# Altium schematic sheet MR_main.SchDoc
size A4; CompanyName: BeeIonic; SheetNumber: 1; SheetTotal: 7
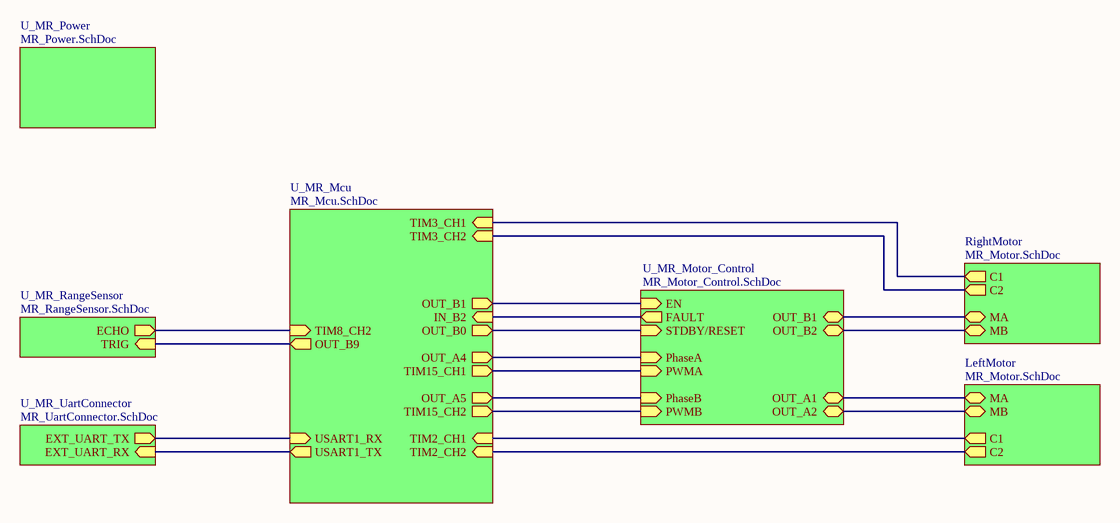
[diagram p0: MR_main.SchDoc]

## Sub-sheets
LeftMotor = MR_Motor.SchDoc: MA (bidir), C1 (out), C2 (out), MB (bidir)
RightMotor = MR_Motor.SchDoc: MA (bidir), C1 (out), C2 (out), MB (bidir)
U_MR_Mcu = MR_Mcu.SchDoc: TIM15_CH2 (out), TIM2_CH1 (in), TIM3_CH2 (in), TIM2_CH2 (in), USART1_RX (in), TIM15_CH1 (out), TIM3_CH1 (in), USART1_TX (out), OUT_B1 (out), OUT_A4 (out), OUT_A5 (out), IN_B2 (in), OUT_B0 (out), TIM8_CH2 (in), OUT_B9 (out)
U_MR_Motor_Control = MR_Motor_Control.SchDoc: OUT_A1 (bidir), PWMB (in), OUT_B1 (bidir), OUT_A2 (bidir), OUT_B2 (bidir), FAULT (out), PhaseA (in), PhaseB (in), STDBY/RESET (in), EN (in), PWMA (in)
U_MR_Power = MR_Power.SchDoc: no entries
U_MR_RangeSensor = MR_RangeSensor.SchDoc: ECHO (out), TRIG (in)
U_MR_UartConnector = MR_UartConnector.SchDoc: EXT_UART_RX (in), EXT_UART_TX (out)

## Nets
(unnamed): sheet U_MR_Mcu/TIM15_CH2, sheet U_MR_Motor_Control/PWMB
(unnamed): sheet U_MR_Mcu/TIM2_CH1, sheet LeftMotor/C1
(unnamed): sheet U_MR_Mcu/TIM3_CH2, sheet RightMotor/C2
(unnamed): sheet U_MR_Mcu/TIM2_CH2, sheet LeftMotor/C2
(unnamed): sheet U_MR_Mcu/USART1_RX, sheet U_MR_UartConnector/EXT_UART_TX
(unnamed): sheet U_MR_Mcu/TIM15_CH1, sheet U_MR_Motor_Control/PWMA
(unnamed): sheet U_MR_Mcu/TIM3_CH1, sheet RightMotor/C1
(unnamed): sheet U_MR_Mcu/USART1_TX, sheet U_MR_UartConnector/EXT_UART_RX
(unnamed): sheet U_MR_Mcu/OUT_B1, sheet U_MR_Motor_Control/EN
(unnamed): sheet U_MR_Mcu/OUT_A4, sheet U_MR_Motor_Control/PhaseA
(unnamed): sheet U_MR_Mcu/OUT_A5, sheet U_MR_Motor_Control/PhaseB
(unnamed): sheet U_MR_Mcu/IN_B2, sheet U_MR_Motor_Control/FAULT
(unnamed): sheet U_MR_Mcu/OUT_B0, sheet U_MR_Motor_Control/STDBY/RESET
(unnamed): sheet U_MR_Mcu/TIM8_CH2, sheet U_MR_RangeSensor/ECHO
(unnamed): sheet U_MR_Mcu/OUT_B9, sheet U_MR_RangeSensor/TRIG
(unnamed): sheet U_MR_Motor_Control/OUT_A1, sheet LeftMotor/MA
(unnamed): sheet U_MR_Motor_Control/OUT_B1, sheet RightMotor/MA
(unnamed): sheet U_MR_Motor_Control/OUT_A2, sheet LeftMotor/MB
(unnamed): sheet U_MR_Motor_Control/OUT_B2, sheet RightMotor/MB

## Notes on the sheet
- Project :
- Title :
- Sheet:
- of
- Creation Date :
- Designer :
- Modified Date :